# EAGLE design sensor_sunstone (EAGLE 7.2.0)
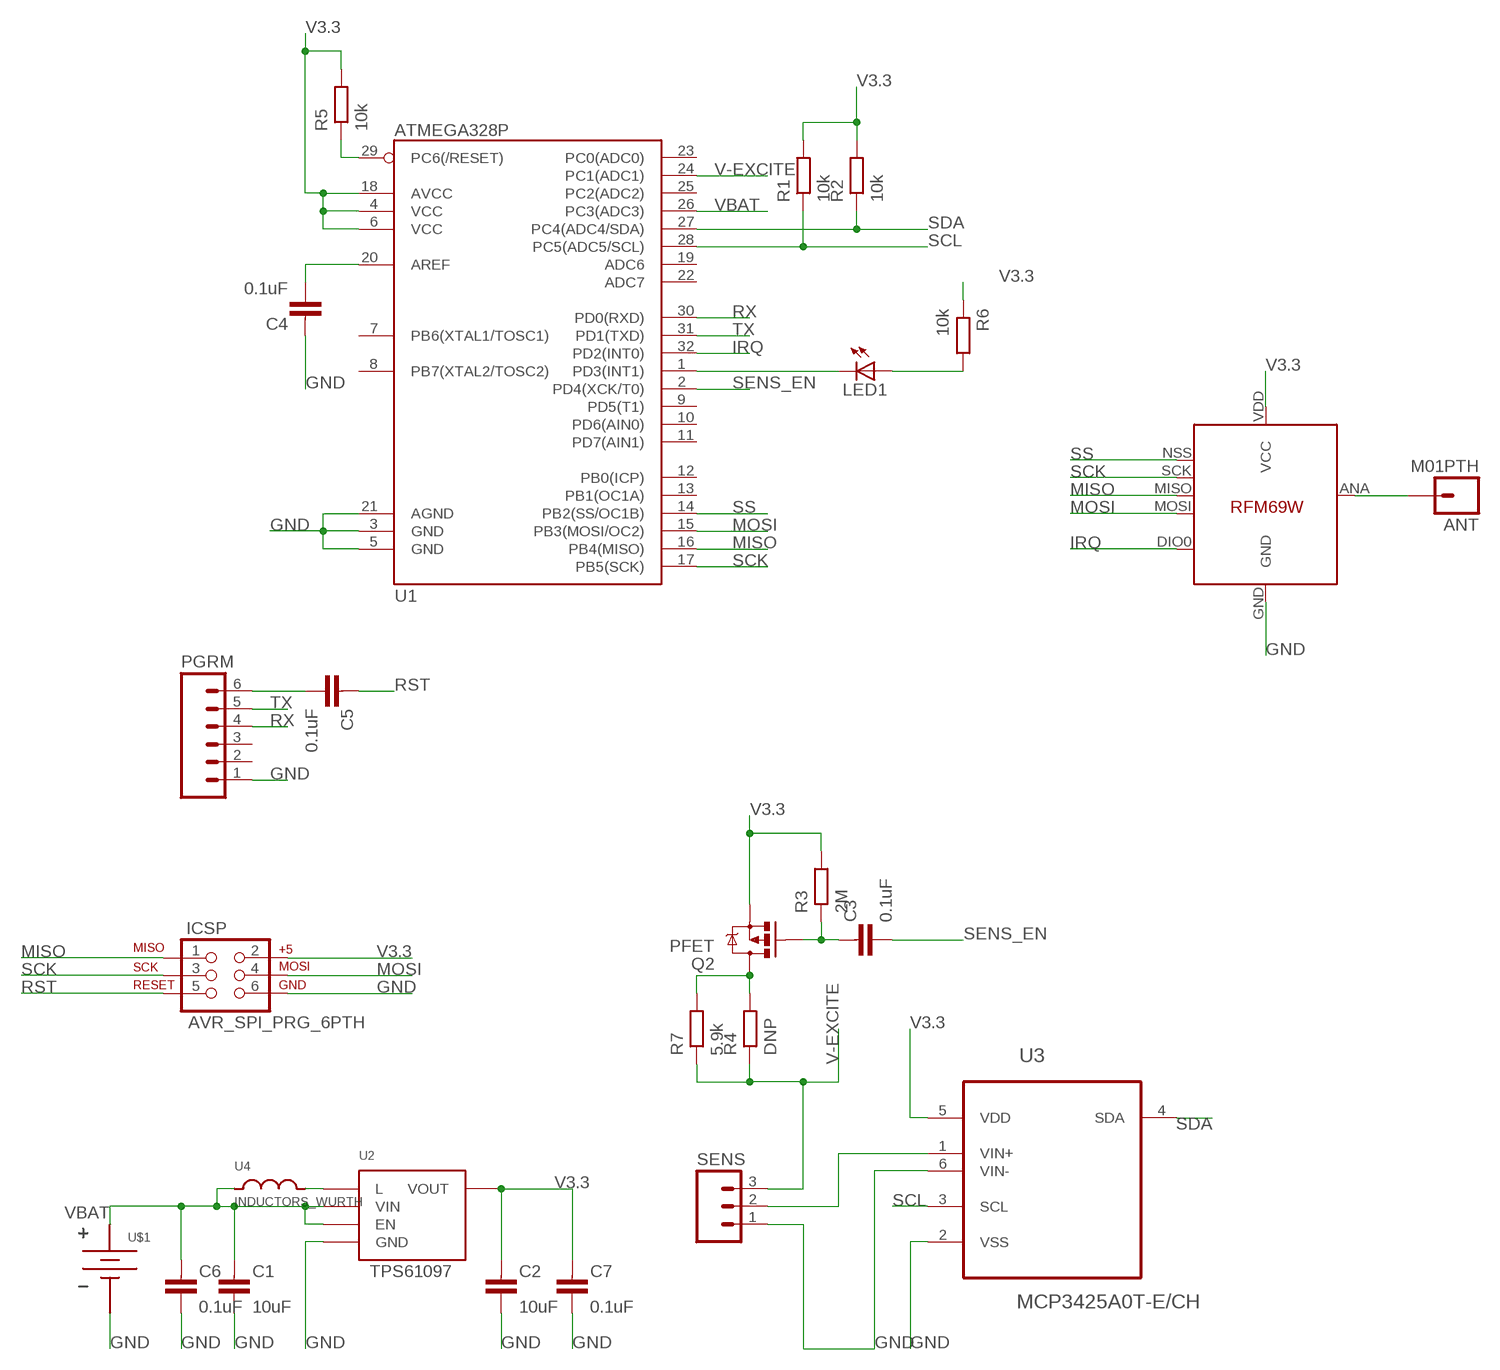
[diagram p0: schematic, sheet 1]

## Parts
ANT  M01PTH  [1X01]
C1  10uF  CAPACITOR0805-N  [C0805-N]
C2  10uF  CAPACITOR0805-N  [C0805-N]
C3  0.1uF  CAPACITOR0603-N  [C0603-N]
C4  0.1uF  CAPACITOR0603-N  [C0603-N]
C5  0.1uF  CAPACITOR0603-N  [C0603-N]
C6  0.1uF  CAPACITOR0603-N  [C0603-N]
C7  0.1uF  CAPACITOR0603-N  [C0603-N]
ICSP  AVR_SPI_PRG_6PTH  [2X3]
LED1  LED0603  [LED-0603]
PGRM  M06LONGPADS  [1X06_LONGPADS]
Q2  PFET  MOSFET-PCHANNELIRLML2244  [SOT23-3]
R1  10k  RESISTOR0603-N  [R0603-N]
R2  10k  RESISTOR0603-N  [R0603-N]
R3  2M  RESISTOR0603-N  [R0603-N]
R4  DNP  RESISTOR0603-N  [R0603-N]
R5  10k  RESISTOR0603-N  [R0603-N]
R6  10k  RESISTOR0603-N  [R0603-N]
R7  5.9k  RESISTOR0603-N  [R0603-N]
SENS  M03PTH  [1X03]
U1  ATMEGA328P  ATMEGA328_SMT  [TQFP32-08]
U2  TPS61097-33  [SOT23-5]
U3  MCP3425A0T-E/CH  [SOT95P270X145-6N]
U4  INDUCTORS_WURTH  [WURTH_10UH_650MA]
U$1  KEYSTONEAAHOLDER_2CELL  [KEYSTONEAAHOLDER_2CELL]
U$5  RFM69  [RFM69W-MINPADS]

## Nets
G: C3.1 Q2.1(G) R3.1
GND: C1.2 C2.2 C4.1 C6.2 C7.2 ICSP.6 PGRM.1 SENS.1 U1.3(GND) U1.5(GND) U1.21(AGND) U2.P$2(GND) U3.2(VSS) U3.6(VIN-) U$1.P$2(GND) U$5.GND
IRQ: U1.32(PD2(INT0)) U$5.DIO0
MISO: ICSP.1 U1.16(PB4(MISO)) U$5.MISO
MOSI: ICSP.4 U1.15(PB3(MOSI/OC2)) U$5.MOSI
N$1: U2.P$5(L) U4.P$1
N$2: Q2.3(D) R4.2 R7.2
N$4: C4.2 U1.20(AREF)
N$5: LED1.C U1.1(PD3(INT1))
N$6: SENS.2 U3.1(VIN+)
N$7: ANT.1 U$5.ANA(ANT)
N$9: LED1.A R6.2
N$10: C5.2 PGRM.6
RST: C5.1 ICSP.5 R5.1 U1.29(PC6(/RESET))
RX: PGRM.4 U1.30(PD0(RXD))
SCK: ICSP.3 U1.17(PB5(SCK)) U$5.SCK
SCL: R1.1 U1.28(PC5(ADC5/SCL)) U3.3(SCL)
SDA: R2.1 U1.27(PC4(ADC4/SDA)) U3.4(SDA)
SENS_EN: C3.2 U1.2(PD4(XCK/T0))
SS: U1.14(PB2(SS/OC1B)) U$5.NSS(SEL)
TX: PGRM.5 U1.31(PD1(TXD))
V3.3: C2.1 C7.1 ICSP.2 Q2.2(S) R1.2 R2.2 R3.2 R5.2 R6.1 U1.4(VCC) U1.6(VCC) U1.18(AVCC) U2.P$4(VOUT) U3.5(VDD) U$5.VDD(VCC)
V-EXCITE: R4.1 R7.1 SENS.3 U1.24(PC1(ADC1))
VBAT: C1.1 C6.1 U1.26(PC3(ADC3)) U2.P$1(VIN) U2.P$3(EN) U4.P$2 U$1.P$1(VBAT)
Unconnected: PGRM.2 PGRM.3 U1.7(PB6(XTAL1/TOSC1)) U1.8(PB7(XTAL2/TOSC2)) U1.9(PD5(T1)) U1.10(PD6(AIN0)) U1.11(PD7(AIN1)) U1.12(PB0(ICP)) U1.13(PB1(OC1A)) U1.19(ADC6) U1.22(ADC7) U1.23(PC0(ADC0)) U1.25(PC2(ADC2))

## Library data of the parts
ANT = SparkFun-Connectors:M01: Header 1 Standard 1-pin 0.1" header. Use with straight break away headers (SKU : PRT-00116), right angle break away headers (PRT-00553), swiss pins (PRT-00743), machine pins (PRT-00117), and female headers (PRT-00115).
C1-C7 = passives-7351:CAPACITOR
ICSP = SparkFun-Connectors:AVR_SPI_PRG_6: AVR ISP 6 Pin This is the reduced ISP connector for AVR programming. Common on Arduino. This footprint will take up less PCB space and can be used with a 10-pin to 6-pin adapter such as SKU: BOB-08508
LED1 = SparkFun-LED:LED: LEDs Standard schematic elements and footprints for 5mm, 3mm, 1206, and 0603 sized LEDs. 5mm - Spark Fun Electronics SKU : COM-00529 (and others)
PGRM = SparkFun-Connectors:M06: Header 6 Standard 6-pin 0.1" header. Use with straight break away headers (SKU : PRT-00116), right angle break away headers (PRT-00553), swiss pins (PRT-00743), machine pins (PRT-00117), and female headers (PRT-00115). Molex polarized connector foot print use with SKU : PRT-08094 with associated crimp pins and housings. NOTES ON THE VARIANTS LOCK and LOCK_LONGPADS... This footprint was designed to help hold the alignment of a through-hole component (i.e. 6-pin header) while soldering it into place. You may notice that each hole has been shifted either up or down by 0.005 of an inch from it's more standard position (which is a perfectly straight line). This slight alteration caused the pins (the squares in the middle) to touch the edges of the holes. Because they are alternating, it causes a "brace" to hold the component in place. 0.005 has proven to be the perfect amount of "off-center" position when using our standard breakaway headers. Although looks a little odd when you look at the bare footprint, once you have a header in there, the alteration is very hard to notice. Also,if you push a header all the way into place, it is covered up entirely on the bottom side. This idea of altering the position of holes to aid alignment will be further integrated into the Sparkfun Library for other footprints. It can help hold any component with 3 or more connection pins.
Q2 = SparkFun-DiscreteSemi:MOSFET-PCHANNEL: Generic PMOSFET IRLML2244 - TRANS-11153 (SOT-23 -20V -4.3A) (1.Gate 2.Source 3.Drain) FQP27P06 - COM-10349 <http://www.sparkfun.com/products/10349> (TO-220 -60V -27A) (1.Gate 2.Source 3.Drain); PROD_ID: TRANS-11153
R1-R7 = passives-7351:RESISTOR
SENS = SparkFun-Connectors:M03: Header 3 Standard 3-pin 0.1" header. Use with straight break away headers (SKU : PRT-00116), right angle break away headers (PRT-00553), swiss pins (PRT-00743), machine pins (PRT-00117), and female headers (PRT-00115). Molex polarized connector foot print use with SKU : PRT-08232 with associated crimp pins and housings.
U1 = SparkFun-DigitalIC:ATMEGA328_SMT: 32-Pin Atmega328 part Commonly used on Arduino compatible boards Available in QFP and QFN packages TQFP is IC-09069 QFN is non-stock; PROD_ID: IC-09069
U2 = _my-parts:TPS61097-33
U3 = Microchip_By_element14_Batch_1:MCP3425A0T-E/CH: Analog-to-Digital Converter; MPN: MCP3425A0T-E/CH; OC_FARNELL: 1578433; OC_NEWARK: 88M9948; PACKAGE: SOT-6; SUPPLIER: Microchip
U4 = _my-parts:INDUCTORS
U$1 = _my-parts:KEYSTONEAAHOLDER_2CELL
U$5 = LowPowerLab:RFM69

## Board
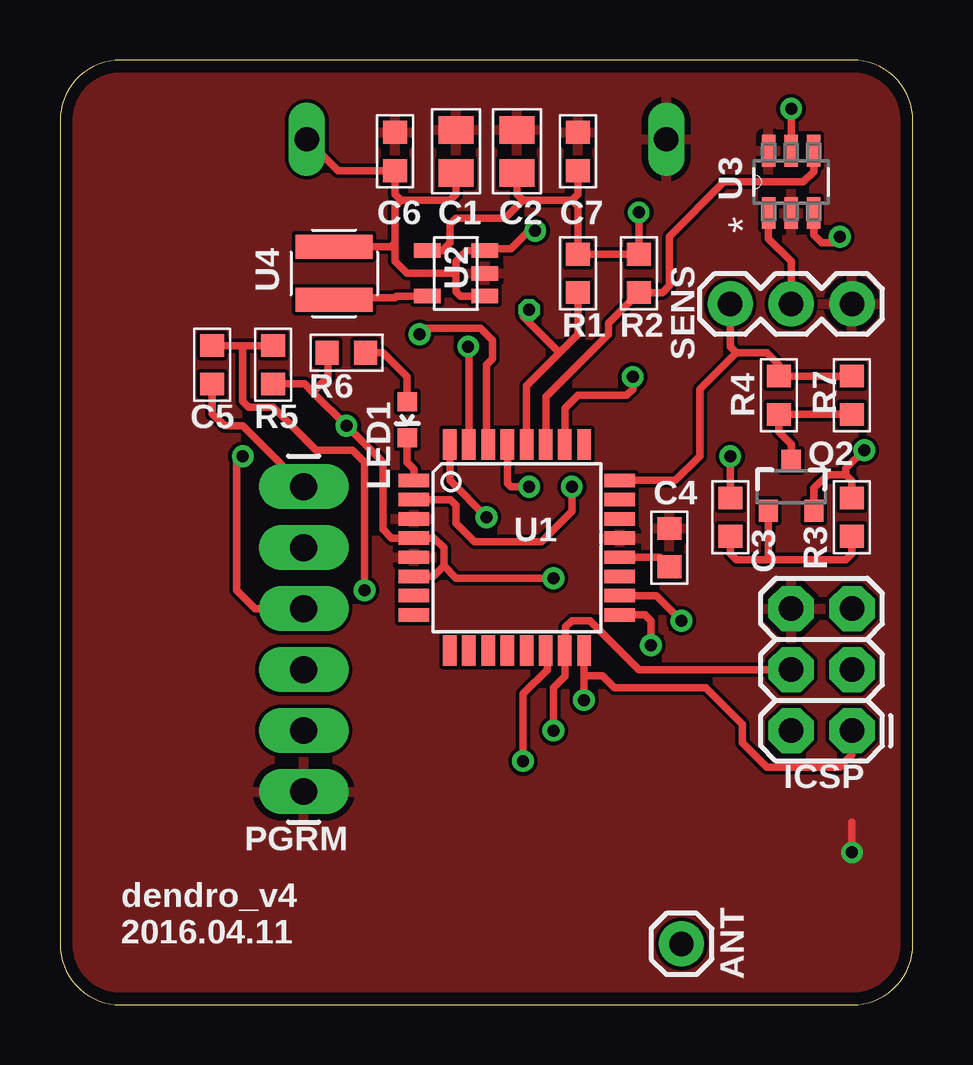
[diagram p1: board, top side]
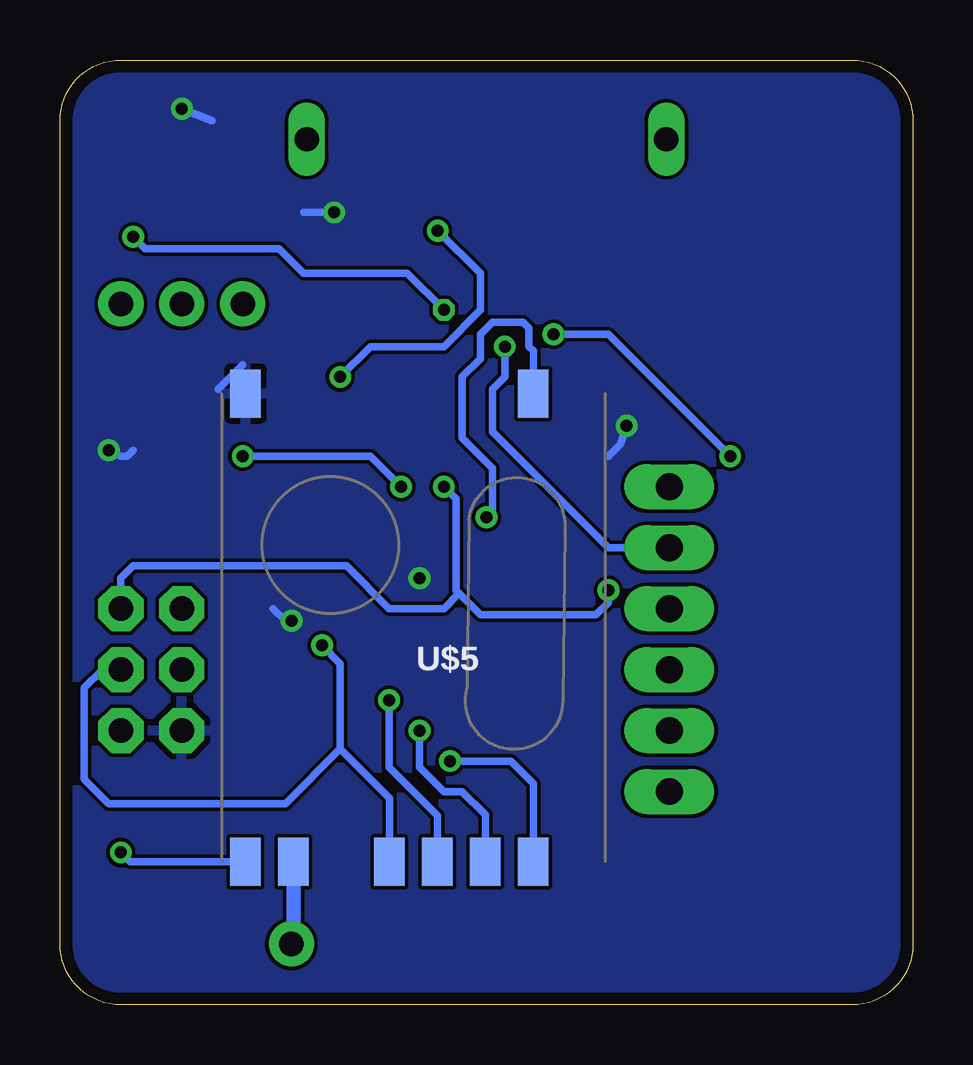
[diagram p2: board, bottom side, seen from below]

Size 35.56 x 39.37 mm. Coordinates in mm from the lower left corner, seen from the top.
Outline: 0,36.83 0,2.54 arc90 2.54,0 33.02,0 arc90 35.56,2.54 35.56,36.83 arc90 33.02,39.37 2.54,39.37 arc90 0,36.83
Copper layers (1*16): Top 0.0178mm / dielectric 59mil / Bottom 0.0178mm
Design rules "SSC-EAGLE-2Lyr_v1.0.0.3": minimum track width 6mil, minimum drill 14mil, track to track 6mil, track to pad 6mil, pad to pad 6mil, via to via 6mil, smd to smd 6mil, copper to edge 20mil, drill to drill 16mil, minimum pad ring 8mil, minimum via ring 8mil, stop-mask expansion 3mil, vias tented up to drill 0mil, thermal gap 10mil

### Footprints (pad centres in the part's own frame; a part is rotated, then mirrored left to right if it is on the bottom)
1X01 = drill 1.016 pad 1.88: 1 0,0
C0805-N = smd 1.15 x 1.45: 1 -0.9,0; 2 0.9,0
C0603-N = smd 0.95 x 1: 1 -0.8,0; 2 0.8,0
2X3 = drill 1.016 pad 1.88 octagon: 1 0,0; 2 0,2.54; 3 2.54,0; 4 2.54,2.54; 5 5.08,0; 6 5.08,2.54
LED-0603 = smd 0.8 x 0.8: A 0,-0.75; C 0,0.75
1X06_LONGPADS = drill 1.118 pad 1.88 long: 1 0,0; 2 2.54,0; 3 5.08,0; 4 7.62,0; 5 10.16,0; 6 12.7,0
SOT23-3 = smd 0.8 x 0.9: 1 -0.95,-1; 2 0.95,-1; 3 0,1.1
R0603-N = smd 0.95 x 1: 1 -0.8,0; 2 0.8,0
1X03 = drill 1.016 pad 1.88: 1 0,0; 2 2.54,0; 3 5.08,0
TQFP32-08 = smd 1.27 x 0.559: 1 -4.293,2.8; 2 -4.293,2; 3 -4.293,1.2; 4 -4.293,0.4; 5 -4.293,-0.4; 6 -4.293,-1.2; 7 -4.293,-2; 8 -4.293,-2.8; 17 4.293,-2.8; 18 4.293,-2; 19 4.293,-1.2; 20 4.293,-0.4; 21 4.293,0.4; 22 4.293,1.2; 23 4.293,2; 24 4.293,2.8 | smd 0.559 x 1.27: 9 -2.8,-4.293; 10 -2,-4.293; 11 -1.2,-4.293; 12 -0.4,-4.293; 13 0.4,-4.293; 14 1.2,-4.293; 15 2,-4.293; 16 2.8,-4.293; 25 2.8,4.293; 26 2,4.293; 27 1.2,4.293; 28 0.4,4.293; 29 -0.4,4.293; 30 -1.2,4.293; 31 -2,4.293; 32 -2.8,4.293
SOT23-5 = smd 0.6 x 1.1: P$1 -0.95,-1.2; P$2 0,-1.2; P$3 0.95,-1.2; P$4 0.95,1.2; P$5 -0.95,1.2
SOT95P270X145-6N = smd 1.321 x 0.559: 1 -1.295,0.94; 2 -1.295,0; 3 -1.295,-0.94; 4 1.295,-0.94; 5 1.295,0; 6 1.295,0.94
WURTH_10UH_650MA = smd 3.2 x 1: P$1 0,-1.1; P$2 0,1.1
KEYSTONEAAHOLDER_2CELL = drill 1.016 pad 1.524 long: P$1 -7.493,27.178; P$2 7.493,27.178
RFM69W-MINPADS = smd 2 x 1.27: ANA 8,-5; DIO0 -11.5,5; GND 8,-7; MISO 8,1; MOSI 8,3; NSS 8,5; SCK 8,-1; VDD -11.5,-7

### Placement (x,y rotation side)
ANT  25.91,2.54 0 top
C1  16.51,35.56 90 top
C2  19.05,35.56 90 top
C3  27.94,20.32 90 top
C4  25.4,19.05 270 top
C5  6.35,26.67 270 top
C6  13.97,35.56 90 top
C7  21.59,35.56 90 top
ICSP  33.02,11.43 90 top
LED1  14.48,24.38 180 top
PGRM  10.16,8.89 90 top
Q2  30.48,21.59 0 top
R1  21.59,30.48 90 top
R2  24.13,30.48 90 top
R3  1M  [R0603-N]  33.02,20.32 90 top
R4  6.8k  [R0603-N]  29.97,25.4 270 top
R5  8.89,26.67 270 top
R6  11.94,27.18 0 top
R7  43k  [R0603-N]  33.02,25.4 270 top
SENS  33.02,29.21 180 top
U1  19.05,19.05 0 top
U2  16.51,30.48 90 top
U3  30.48,34.29 90 top
U4  11.43,30.48 0 top
U$1  17.78,8.89 0 top
U$5  20.83,13.97 270 bottom

### Tracks (layer width: path | path; a pad name or v marks a point on that pad's centre or on a via)
G
  Top 0.305: C3.1 27.94,18.8 28.19,18.54 29.46,18.54 | 29.46,18.54 32.77,18.54 33.02,18.8 R3.1 | Q2.1 29.53,18.61 29.46,18.54
GND  (via drill 0.5)
  Top 0.305: v33.02,6.35 33.02,7.62
  Bottom 0.305: v33.02,6.35 32.64,5.97 U$5.GND
  pour Top: -1.27,0 36.83,0 36.83,40.64 -1.27,40.64
IRQ  (via drill 0.5)
  Top 0.305: U1.32 16.25,21.85 v17.78,20.32
  Bottom 0.305: 17.86,20.4 v17.78,20.32 17.53,20.57 17.53,22.35 18.8,23.62 18.8,26.16 18.03,26.92 18.03,27.94 17.53,28.45 16.26,28.45 16,28.19 16,27.43 15.83,27.26 U$5.DIO0
MISO  (via drill 0.5)
  Top 0.305: U1.16 21.85,13.72 | 21.85,13.72 v21.85,12.71 v21.84,12.7 | ICSP.1 33.02,10.41 32.51,9.91 29.46,9.91 28.45,10.92 28.45,11.68 26.92,13.21 23.11,13.21 22.61,13.72 21.85,13.72
  Bottom 0.305: U$5.MISO 19.83,7.89 21.84,9.91 v21.84,12.7
MOSI  (via drill 0.5)
  Top 0.305: v20.57,11.43 20.57,13.21 21.05,13.68 U1.15 21.08,14.79 21.08,15.75 21.34,16 22.1,16 24.13,13.97 ICSP.4
  Bottom 0.305: U$5.MOSI 17.83,7.92 18.8,8.89 19.56,8.89 20.57,9.91 v20.57,11.43
N$1
  Top 0.305: U2.P$5 14.04,29.53 13.97,29.46 11.51,29.46 U4.P$1
N$2
  Top 0.305: Q2.3 30.48,23.37 29.97,23.88 R4.2 R7.2
N$4
  Top 0.305: U1.20 25,18.65 C4.2
N$5
  Top 0.305: U1.1 14.76,22.33 14.48,22.61 LED1.C
N$6
  Top 0.305: SENS.2 30.48,30.99 29.54,31.93 U3.1
N$7
  Bottom 0.61: U$5.ANA 25.83,2.62 ANT.1
N$9
  Top 0.305: R6.2 13.46,27.18 14.48,26.16 LED1.A
N$10
  Top 0.305: C5.2 6.35,24.64 6.86,24.13 7.62,24.13 PGRM.6
RST  (via drill 0.5)
  Top 0.305: v19.56,21.59 18.8,21.59 18.65,21.74 U1.29 | v12.7,17.27 12.7,22.61 12.19,23.11 10.67,23.11 8.89,24.89 7.87,24.89 7.62,25.15 7.62,27.43 7.66,27.47 R5.1 C5.1
  Bottom 0.305: v19.56,21.59 19.05,21.08 19.05,17.27 18.92,17.14 | 18.92,17.14 18.03,16.26 13.21,16.26 12.7,16.76 v12.7,17.27 | ICSP.5 33.02,17.78 32.51,18.29 23.62,18.29 21.84,16.51 19.56,16.51 18.92,17.14
RX  (via drill 0.5)
  Top 0.305: PGRM.4 8.13,16.51 7.37,17.27 7.37,22.61 v7.62,22.86 | U1.30 17.78,23.41 17.78,26.67 18.03,26.92 18.03,27.69 17.53,28.19 15.24,28.19 v14.99,27.94
  Bottom 0.305: v7.62,22.86 12.7,27.94 v14.99,27.94
SCK  (via drill 0.5)
  Top 0.305: v24.64,14.99 24.64,16 24.38,16.26 U1.17
  Bottom 0.305: v24.64,14.99 23.88,14.22 23.88,10.67 | U$5.SCK 21.83,8.62 23.88,10.67 | ICSP.3 33.78,13.97 34.54,13.21 34.54,9.4 33.53,8.38 26.16,8.38 23.88,10.67
SCL  (via drill 0.5, 0.51)
  Top 0.305: U1.28 19.45,25.8 20.83,27.18 | 20.83,27.18 21.59,27.94 R1.1 | v19.56,28.96 19.3,28.7 20.83,27.18 | U3.3 31.42,32.08 31.75,31.75 32.26,31.75 v32.51,32
  Bottom 0.305: v19.56,28.96 21.08,30.48 25.4,30.48 26.42,31.5 32,31.5 v32.51,32
SDA
  Top 0.305: U1.27 20.25,25.33 22.86,27.94 22.86,28.41 R2.1 25.11,29.68 25.4,29.97 25.4,32 27.69,34.29 30.99,34.29 31.42,34.72 U3.4
SENS_EN  (via drill 0.5)
  Top 0.305: C3.2 v27.94,22.86 | v21.34,21.59 21.34,20.57 20.07,19.3 17.27,19.3 16.51,20.07 16.51,20.83 16.29,21.05 U1.2
  Bottom 0.305: v27.94,22.86 22.61,22.86 v21.34,21.59
SS  (via drill 0.5)
  Top 0.305: v19.3,10.16 19.3,12.95 20.32,13.97 20.32,14.69 U1.14
  Bottom 0.305: U$5.NSS 15.83,9.22 16.76,10.16 v19.3,10.16
TX  (via drill 0.5)
  Top 0.305: U1.31 17.05,27.4 v17.02,27.43
  Bottom 0.305: PGRM.5 12.7,19.05 17.53,23.88 17.53,25.65 17.02,26.16 v17.02,27.43
V3.3  (via drill 0.5, 0.51)
  Top 0.305: C2.1 19.05,33.78 19.3,33.53 | 19.3,33.53 21.34,33.53 | 21.34,33.53 21.59,33.78 C7.1 | U2.P$4 15.94,31.43 16.26,31.75 16.26,32.51 16.51,32.77 18.54,32.77 19.3,33.53 | Q2.2 31.43,21.52 32,22.1 32.77,22.1 | 21.34,33.53 21.59,33.27 R1.2 R2.2 v24.13,33.02 | U3.5 v30.48,37.34 | U1.18 24.86,17.05 v25.91,16 | U1.6 15.56,17.85 16,18.29 | 16,18.29 16,19.05 15.6,19.45 U1.4 13.82,19.45 13.46,19.81 13.46,22.61 v11.94,24.13 10.54,25.53 | v20.57,17.78 16.51,17.78 16,18.29 | R3.2 33.02,21.84 32.77,22.1 | 32.77,22.1 32.77,22.35 v33.53,23.11 | R6.1 11.43,27.18 11.18,26.92 11.18,26.16 10.54,25.53 | R5.2 10.2,25.87 10.54,25.53
  Bottom 0.305: 28.96,25.65 27.94,26.67 | v30.48,37.34 29.21,36.83 | v24.13,33.02 25.4,33.02 | v25.91,16 26.16,16 26.67,16.51 | v11.94,24.13 12.19,23.37 12.7,22.86 | v33.53,23.11 33.02,22.86 32.77,22.86 32.51,23.11
  pour Bottom: -2.54,-1.27 38.1,-1.27 38.1,43.18 -2.54,43.18
V-EXCITE
  Top 0.305: 28.19,27.18 27.94,27.43 SENS.3 | U1.24 25.66,21.85 26.67,22.86 26.67,25.65 28.19,27.18 | R7.1 R4.1 29.97,26.67 29.46,27.18 28.19,27.18
VBAT  (via drill 0.5)
  Top 0.305: 14.22,33.53 13.97,33.78 C6.1 11.6,34.76 U$1.P$1 | C1.1 16.51,33.78 16.26,33.53 14.22,33.53 | U4.P$2 13.8,31.58 13.97,31.75 | 13.97,31.75 13.97,33.27 14.22,33.53 | U2.P$1 16.7,29.53 16.51,29.72 16.51,30.48 | 16.51,30.48 16.51,30.99 16.95,31.43 U2.P$3 17.78,31.5 18.8,31.5 19.56,32.26 v19.81,32.26 | 13.97,31.75 13.97,30.99 14.48,30.48 16.51,30.48 | U1.26 21.05,24.86 21.59,25.4 23.62,25.4 23.88,25.65 v23.88,26.16
  Bottom 0.305: v23.88,26.16 22.61,27.43 19.56,27.43 18.03,28.96 18.03,30.48 v19.81,32.26

### Text on the board
tNames: U4 | dendro_v4 / 2016.04.11